# Altium schematic sheet 90.IR Receiver_LED.SchDoc
size 297 x 209 mm; Revision: V2.1; Schematic Page Number: 11; Page Number: 37; Check: Default; Schematic Name: RK_NVR_DEMO1_RK3588_LP4/4x_V21; Page Count: 43; Page name: 90.IR Receiver/LED; Designer: Zhangdz; Schematic Page Count: 99; Revcode: V2.1; DsnPath: E:\Work\SBER\RK3588_SOM\temp\RK_NVR_DEMO1_RK3588_LP4XD200P232SD8_V21_20211228.DSN; SchematicName: RK_NVR_DEMO1_RK3588_LP4/4x_V21; PageName: 90.IR Receiver/LED; PageSize: A4; TopSchematic: True
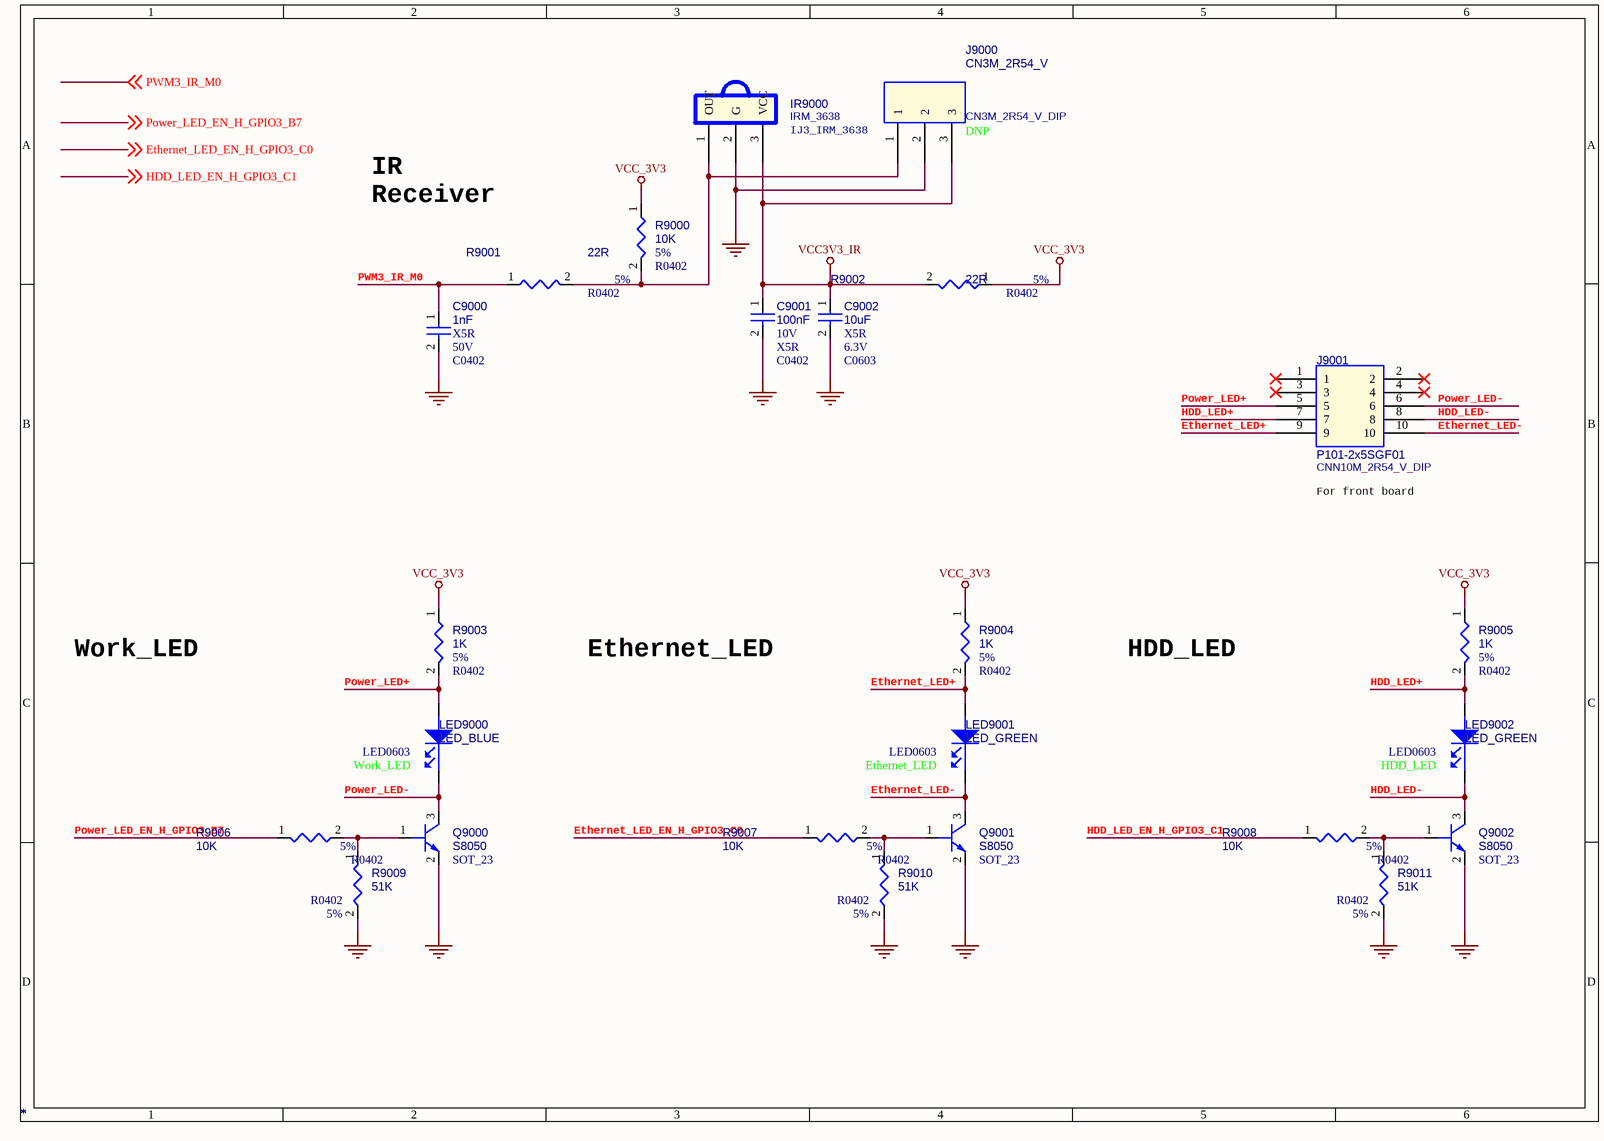
[diagram p0: 90.IR Receiver_LED.SchDoc]

## Parts
C9000  *  Voltage: 50V  Dielectric: X5R  [C0402]
C9001  *  Voltage: 10V  Dielectric: X5R  [C0402]
C9002  *  Voltage: 6.3V  Dielectric: X5R  [C0603]
IR9000  *  PCB Footprint: IJ3_IRM_3638  [IR3DIP]
J9000  *  PCB Footprint: CN3M_2R54_V_DIP  option: DNP  [DIP3_1X3_2R54]
J9001  *  PCB Footprint: CNN10M_2R54_V_DIP  [JTAG_2X10_2R54]
LED9000  *  option: Work_LED  [LED0603]
LED9001  *  option: Ethernet_LED  [LED0603]
LED9002  *  option: HDD_LED  [LED0603]
Q9000  *  [SOT_23]
Q9001  *  [SOT_23]
Q9002  *  [SOT_23]
R9000  *  Tolerance: 5%  [R0402]
R9001  *  Tolerance: 5%  [R0402]
R9002  *  Tolerance: 5%  [R0402]
R9003  *  Tolerance: 5%  [R0402]
R9004  *  Tolerance: 5%  [R0402]
R9005  *  Tolerance: 5%  [R0402]
R9006  *  Tolerance: 5%  [R0402]
R9007  *  Tolerance: 5%  [R0402]
R9008  *  Tolerance: 5%  [R0402]
R9009  *  Tolerance: 5%  [R0402]
R9010  *  Tolerance: 5%  [R0402]
R9011  *  Tolerance: 5%  [R0402]

## Nets
GND: C9000.2 C9001.2 C9002.2 IR9000.2(G) J9000.2 Q9000.2(EMITTER) Q9001.2(EMITTER) Q9002.2(EMITTER) R9009.2 R9010.2 R9011.2
VCC3V3_IR: C9001.1 C9002.1 IR9000.3(VCC) J9000.3 R9002.2
VCC_3V3: R9000.1 R9002.1 R9003.1 R9004.1 R9005.1
Ethernet_LED+: J9001.9 LED9001.1(ANODE) R9004.2
Ethernet_LED-: J9001.10 LED9001.2(CATHODE) Q9001.3(COLLECTOR)
Ethernet_LED_EN_H_GPIO3_C0: R9007.1 ; off-sheet Ethernet_LED_EN_H_GPIO3_C0
HDD_LED+: J9001.7 LED9002.1(ANODE) R9005.2
HDD_LED-: J9001.8 LED9002.2(CATHODE) Q9002.3(COLLECTOR)
HDD_LED_EN_H_GPIO3_C1: R9008.1 ; off-sheet HDD_LED_EN_H_GPIO3_C1
Power_LED+: J9001.5 LED9000.1(ANODE) R9003.2
Power_LED-: J9001.6 LED9000.2(CATHODE) Q9000.3(COLLECTOR)
Power_LED_EN_H_GPIO3_B7: R9006.1 ; off-sheet Power_LED_EN_H_GPIO3_B7
PWM3_IR_M0: C9000.1 R9001.1 ; off-sheet PWM3_IR_M0
NetIR9000_1: IR9000.1(OUT) J9000.1 R9000.2 R9001.2
NetQ9000_1: Q9000.1(BASE) R9006.2 R9009.1
NetQ9001_1: Q9001.1(BASE) R9007.2 R9010.1
NetQ9002_1: Q9002.1(BASE) R9008.2 R9011.1

Not connected (* = marked no-connect by the designer): J9001 1* 2* 3* 4*

## Notes on the sheet
- IR
  Receiver
- For front board
- Work_LED
- Ethernet_LED
- HDD_LED

## Library data of the parts
C9000 = CAP NP: cap,1.00nF,+/-10%,50V,X5R,C0402; Part Reference: C9000; Manufacturer PN: C1005X5R1H102K050BA; Manufacturer: TDK; Value: 1nF; Tolerance: 10%; Priority: A; PCB Footprint: C0402; Created by: JJJ; Part Type: C0402; RK PN: C1005X5R1H102K050BA
C9001 = CAP NP: cap,100.00nF,+/-10%,10V,X5R,C0402; Part Reference: C9001; Manufacturer PN: C1005X5R1A104K050BA; Manufacturer: TDK; Value: 100nF; Tolerance: 10%; Priority: A; PCB Footprint: C0402; Created by: JJJ; Part Type: C0402; RK PN: C1005X5R1A104K050BA
C9002 = CAP NP: cap,10.00uF,+/-10%,6.3V,X5R,C0603; Part Reference: C9002; Manufacturer PN: C1608X5R0J106K080AB; Manufacturer: TDK; Value: 10uF; Tolerance: 10%; Priority: A; PCB Footprint: C0603; Created by: JJJ; Part Type: C0603; RK PN: C1608X5R0J106K080AB
IR9000 = IRM_0: ємНвЅУКХН·; Part Reference: IR9000; Manufacturer: ТЪ№в; Value: IRM_3638; Priority: A; RK PN: IRM_3638; Part Type: IR; Manufacturer Part Number: IRM_3638; Created by: JJJ
J9000 = CON3_1X3: µҐЕЕ3PINЈЁјдѕа2.54mmЈ©І»ґш·А»¤ЗЅµДІеХл; Part Reference: J9000; Manufacturer: НъїЖґп; Value: CN3M_2R54_V; RK PN: CON3M_1X3_2R54_V; Priority: A; Part Type: Header; Manufacturer Part Number: CON3M_1X3_2R54_V; Created by: JJJ
J9001 = CON20_0: Л«ЕЕ10PINЈЁјдѕа2.54mmЈ©І»ґш·А»¤ЗЅµДІеХл,БўКЅЈ¬№«Чщ; Part Reference: J9001; Manufacturer: СwХэµзЧУ; Value: P101-2x5SGF01; RK PN: P101-2x10SGF01; Priority: A; Part Type: Header; Manufacturer Part Number: P101-2x10SGF01; Created by: JJJ
LED9000 = LED: МщЖ¬LEDµЖЈ¬0603Ј¬А¶Й«; Part Reference: LED9000; Value: LED_BLUE; Priority: A; PCB Footprint: LED0603; Created by: JJJ; Part Type: LED; RK PN: LED_BLUE
LED9001 = LED: МщЖ¬LEDµЖЈ¬0603Ј¬ВМЙ«; Part Reference: LED9001; Value: LED_GREEN; Priority: A; PCB Footprint: LED0603; RK PN: LED_GREEN; Part Type: LED; Created by: JJJ
LED9002 = LED: МщЖ¬LEDµЖЈ¬0603Ј¬ВМЙ«; Part Reference: LED9002; Value: LED_GREEN; Priority: A; PCB Footprint: LED0603; RK PN: LED_GREEN; Part Type: LED; Created by: JJJ
Q9000 = NPN: S8050,SOT23; Part Reference: Q9000; Manufacturer: і¤µз; Manufacturer PN: S8050_SOT23; Priority: A; Ic: 0.5A; Vceo: 25V; Pc: 0.3W; PCB Footprint: SOT_23; Value: S8050; RK PN: S8050; Part Type: NPN; Created by: JJJ
Q9001 = NPN: S8050,SOT23; Part Reference: Q9001; Manufacturer: і¤µз; Manufacturer PN: S8050_SOT23; Priority: A; Ic: 0.5A; Vceo: 25V; Pc: 0.3W; PCB Footprint: SOT_23; Value: S8050; RK PN: S8050; Part Type: NPN; Created by: JJJ
Q9002 = NPN: S8050,SOT23; Part Reference: Q9002; Manufacturer: і¤µз; Manufacturer PN: S8050_SOT23; Priority: A; Ic: 0.5A; Vceo: 25V; Pc: 0.3W; PCB Footprint: SOT_23; Value: S8050; RK PN: S8050; Part Type: NPN; Created by: JJJ
R9000 = RESISTOR_Dup1: НЁУГєсД¤µзЧи,10K,+/-5%,R0402,1/16W.; Part Reference: R9000; Manufacturer PN: RC0402JR-0710KL; Manufacturer: YAGEO; Wattage: 1/16W; Priority: A; PCB Footprint: R0402; Value: 10K; Created by: YTL; Part Type: НЁУГєсД¤µзЧи; RK PN: RC0402JR-0710KL
R9001 = RESISTOR_Dup1: НЁУГєсД¤µзЧи,22R,+/-5%,R0402,1/16W.; Part Reference: R9001; Manufacturer: YAGEO; RK PN: RC0402JR-0722RL; Priority: A; Wattage: 1/16W; PCB Footprint: R0402; Value: 22R; Part Type: НЁУГєсД¤µзЧи; Manufacturer PN: RC0402JR-0722RL; Created by: YTL
R9002 = RESISTOR_Dup1: НЁУГєсД¤µзЧи,22R,+/-5%,R0402,1/16W.; Part Reference: R9002; Manufacturer: YAGEO; RK PN: RC0402JR-0722RL; Priority: A; Wattage: 1/16W; PCB Footprint: R0402; Value: 22R; Part Type: НЁУГєсД¤µзЧи; Manufacturer PN: RC0402JR-0722RL; Created by: YTL
R9003 = RESISTOR_Dup1: НЁУГєсД¤µзЧи,1K,+/-5%,R0402,1/16W.; Part Reference: R9003; Manufacturer PN: RC0402JR-071KL; Manufacturer: YAGEO; Wattage: 1/16W; Priority: A; PCB Footprint: R0402; Value: 1K; Created by: YTL; Part Type: НЁУГєсД¤µзЧи; RK PN: RC0402JR-071KL
R9004 = RESISTOR_Dup1: НЁУГєсД¤µзЧи,1K,+/-5%,R0402,1/16W.; Part Reference: R9004; Manufacturer: YAGEO; RK PN: RC0402JR-071KL; Priority: A; Wattage: 1/16W; PCB Footprint: R0402; Value: 1K; Part Type: НЁУГєсД¤µзЧи; Manufacturer PN: RC0402JR-071KL; Created by: YTL
R9005 = RESISTOR_Dup1: НЁУГєсД¤µзЧи,1K,+/-5%,R0402,1/16W.; Part Reference: R9005; Manufacturer PN: RC0402JR-071KL; Manufacturer: YAGEO; Wattage: 1/16W; Priority: A; PCB Footprint: R0402; Value: 1K; Created by: YTL; Part Type: НЁУГєсД¤µзЧи; RK PN: RC0402JR-071KL
R9006 = RESISTOR_Dup1: НЁУГєсД¤µзЧи,10K,+/-5%,R0402,1/16W.; Part Reference: R9006; Manufacturer: YAGEO; RK PN: RC0402JR-0710KL; Priority: A; Wattage: 1/16W; PCB Footprint: R0402; Value: 10K; Part Type: НЁУГєсД¤µзЧи; Manufacturer PN: RC0402JR-0710KL; Created by: YTL
R9007 = RESISTOR_Dup1: НЁУГєсД¤µзЧи,10K,+/-5%,R0402,1/16W.; Part Reference: R9007; Manufacturer: YAGEO; RK PN: RC0402JR-0710KL; Priority: A; Wattage: 1/16W; PCB Footprint: R0402; Value: 10K; Part Type: НЁУГєсД¤µзЧи; Manufacturer PN: RC0402JR-0710KL; Created by: YTL
R9008 = RESISTOR_Dup1: НЁУГєсД¤µзЧи,10K,+/-5%,R0402,1/16W.; Part Reference: R9008; Manufacturer: YAGEO; RK PN: RC0402JR-0710KL; Priority: A; Wattage: 1/16W; PCB Footprint: R0402; Value: 10K; Part Type: НЁУГєсД¤µзЧи; Manufacturer PN: RC0402JR-0710KL; Created by: YTL
R9009 = RESISTOR_Dup1: НЁУГєсД¤µзЧи,51K,+/-5%,R0402,1/16W.; Part Reference: R9009; Manufacturer: YAGEO; RK PN: RC0402JR-0751KL; Priority: A; Wattage: 1/16W; PCB Footprint: R0402; Value: 51K; Part Type: НЁУГєсД¤µзЧи; Manufacturer PN: RC0402JR-0751KL; Created by: YTL
R9010 = RESISTOR_Dup1: НЁУГєсД¤µзЧи,51K,+/-5%,R0402,1/16W.; Part Reference: R9010; Manufacturer: YAGEO; RK PN: RC0402JR-0751KL; Priority: A; Wattage: 1/16W; PCB Footprint: R0402; Value: 51K; Part Type: НЁУГєсД¤µзЧи; Manufacturer PN: RC0402JR-0751KL; Created by: YTL
R9011 = RESISTOR_Dup1: НЁУГєсД¤µзЧи,51K,+/-5%,R0402,1/16W.; Part Reference: R9011; Manufacturer: YAGEO; RK PN: RC0402JR-0751KL; Priority: A; Wattage: 1/16W; PCB Footprint: R0402; Value: 51K; Part Type: НЁУГєсД¤µзЧи; Manufacturer PN: RC0402JR-0751KL; Created by: YTL